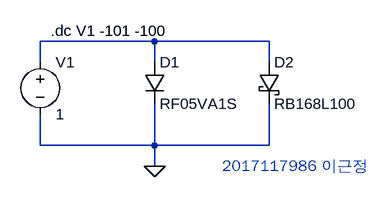
[diagram p0: schematic HW1.asc]
HW1.asc, the LTspice schematic file:
Version 4
SHEET 1 880 680
WIRE 144 128 -32 128
WIRE 320 128 144 128
WIRE -32 160 -32 128
WIRE 144 160 144 128
WIRE 320 160 320 128
WIRE -32 288 -32 240
WIRE 144 288 144 224
WIRE 144 288 -32 288
WIRE 320 288 320 224
WIRE 320 288 144 288
WIRE 144 320 144 288
FLAG 144 320 0
SYMBOL diode 128 160 R0
SYMATTR InstName D1
SYMATTR Value RF05VA1S
SYMBOL schottky 304 160 R0
SYMATTR InstName D2
SYMATTR Value RB168L100
SYMBOL voltage -32 144 R0
WINDOW 123 0 0 Left 0
WINDOW 39 0 0 Left 0
SYMATTR InstName V1
SYMATTR Value 1
TEXT -16 112 Left 2 !.dc V1 -101 -100
TEXT 248 320 Left 2 ;2017117986 이근정

The netlist it stands for:
* HW1.asc
D1 N001 0 RF05VA1S
D2 N001 0 RB168L100
V1 N001 0 1
.model D D
.lib standard.dio
.dc V1 -101 -100
* 2017117986 이근정
.backanno
.end